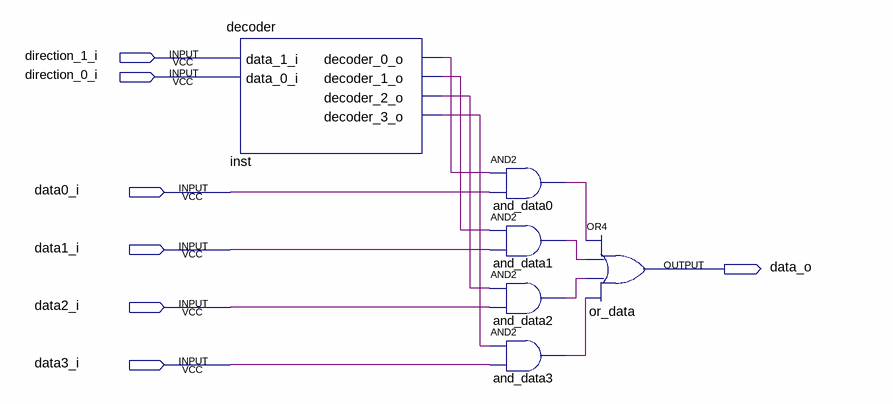
[diagram p0: schematic sheet]
// Quartus schematic mux_4_1.bdf as structural Verilog: 6 symbols, 7 pins
module mux_4_1 (
  input  direction_1_i,
  input  direction_0_i,
  input  data0_i,
  input  data1_i,
  input  data2_i,
  input  data3_i,
  output data_o
);

  wire and_data0_out, and_data1_out, and_data2_out, and_data3_out, inst_decoder_0_o, inst_decoder_1_o,
       inst_decoder_2_o, inst_decoder_3_o;

  decoder inst (
    .data_1_i(direction_1_i), .data_0_i(direction_0_i), .decoder_0_o(inst_decoder_0_o),
    .decoder_1_o(inst_decoder_1_o), .decoder_2_o(inst_decoder_2_o), .decoder_3_o(inst_decoder_3_o));
  and and_data0 (and_data0_out, inst_decoder_0_o, data0_i);
  and and_data1 (and_data1_out, inst_decoder_1_o, data1_i);
  and and_data2 (and_data2_out, inst_decoder_2_o, data2_i);
  and and_data3 (and_data3_out, inst_decoder_3_o, data3_i);
  or or_data (data_o, and_data0_out, and_data1_out, and_data2_out, and_data3_out);
endmodule
